# Altium schematic sheet Juglans.SchDoc
size A4
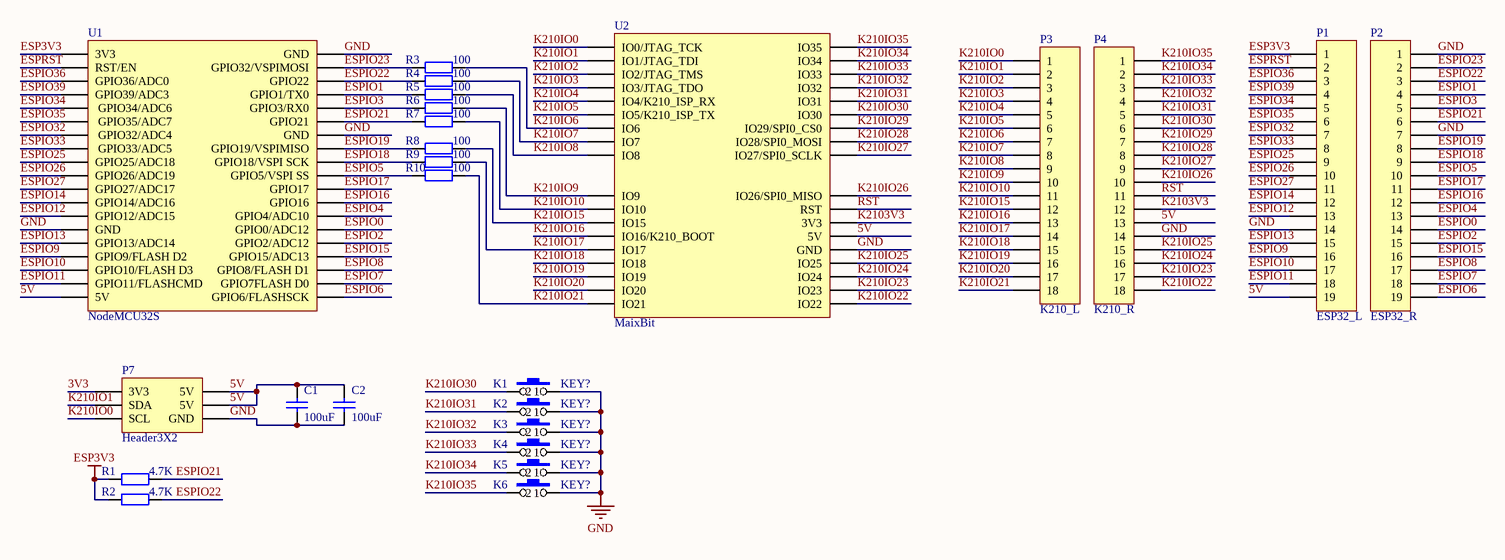
[diagram p0: Juglans.SchDoc]

## Parts
C1  value 100uF  [C 1206_L]  (hidden comment: Cap)
C2  value 100uF  [C 1206_L]  (hidden comment: Cap)
K1  KEY?  [SW-PB2-S]
K2  KEY?  [SW-PB2-S]
K3  KEY?  [SW-PB2-S]
K4  KEY?  [SW-PB2-S]
K5  KEY?  [SW-PB2-S]
K6  KEY?  [SW-PB2-S]
P1  ESP32_L  [HDR1X19]
P2  ESP32_R  [HDR1X19]
P3  K210_L  [HDR1X18]
P4  K210_R  [HDR1X18]
P7  Header3X2  [Header3X2]
R1  value 4.7K  [R 0805_M]  (hidden comment: Res2)
R2  value 4.7K  [R 0805_M]  (hidden comment: Res2)
R3  value 100  [R 0805_M]  (hidden comment: Res2)
R4  value 100  [R 0805_M]  (hidden comment: Res2)
R5  value 100  [R 0805_M]  (hidden comment: Res2)
R6  value 100  [R 0805_M]  (hidden comment: Res2)
R7  value 100  [R 0805_M]  (hidden comment: Res2)
R8  value 100  [R 0805_M]  (hidden comment: Res2)
R9  value 100  [R 0805_M]  (hidden comment: Res2)
R10  value 100  [R 0805_M]  (hidden comment: Res2)
U1  NodeMCU32S  [NodeMCU32S]
U2  MaixBit  [MaixBit]

## Nets
ESP3V3: P1.1 R1.2 R2.2 U1.0(3V3)
GND: C1.1 C2.1 K1.2 K2.2 K3.2 K4.2 K5.2 K6.2 P1.14 P2.1 P2.7 P4.14 P7.6(GND) U1.13(GND) U1.31(GND) U1.37(GND) U2.22(GND)
3V3: P7.1(3V3)
5V: C1.2 C2.2 P1.19 P4.13 P7.2(5V) P7.4(5V) U1.18(5V) U2.23(5V)
ESPIO0: P2.14 U1.24(GPIO0/ADC12)
ESPIO1: P2.4 R5.2 U1.34(GPIO1/TX0)
ESPIO2: P2.15 U1.23(GPIO2/ADC12)
ESPIO3: P2.5 R6.2 U1.33(GPIO3/RX0)
ESPIO4: P2.13 U1.25(GPIO4/ADC10)
ESPIO5: P2.10 R10.2 U1.28(GPIO5/VSPI_SS)
ESPIO6: P2.19 U1.19(GPIO6/FLASHSCK)
ESPIO7: P2.18 U1.20(GPIO7FLASH_D0)
ESPIO8: P2.17 U1.21(GPIO8/FLASH_D1)
ESPIO9: P1.16 U1.15(GPIO9/FLASH_D2)
ESPIO10: P1.17 U1.16(GPIO10/FLASH_D3)
ESPIO11: P1.18 U1.17(GPIO11/FLASHCMD)
ESPIO12: P1.13 U1.12(GPIO12/ADC15)
ESPIO13: P1.15 U1.14(GPIO13/ADC14)
ESPIO14: P1.12 U1.11(GPIO14/ADC16)
ESPIO15: P2.16 U1.22(GPIO15/ADC13)
ESPIO16: P2.12 U1.26(GPIO16)
ESPIO17: P2.11 U1.27(GPIO17)
ESPIO18: P2.9 R9.2 U1.29(GPIO18/VSPI_SCK)
ESPIO19: P2.8 R8.2 U1.30(GPIO19/VSPIMISO)
ESPIO21: P2.6 R1.1 R7.2 U1.32(GPIO21)
ESPIO22: P2.3 R2.1 R4.2 U1.35(GPIO22)
ESPIO23: P2.2 R3.2 U1.36(GPIO32/VSPIMOSI)
ESPIO25: P1.9 U1.8(GPIO25/ADC18)
ESPIO26: P1.10 U1.9(GPIO26/ADC19)
ESPIO27: P1.11 U1.10(GPIO27/ADC17)
ESPIO32: P1.7 U1.6(GPIO32/ADC4)
ESPIO33: P1.8 U1.7(GPIO33/ADC5)
ESPIO34: P1.5 U1.4(GPIO34/ADC6)
ESPIO35: P1.6 U1.5(GPIO35/ADC7)
ESPIO36: P1.3 U1.2(GPIO36/ADC0)
ESPIO39: P1.4 U1.3(GPIO39/ADC3)
ESPRST: P1.2 U1.1(RST/EN)
K210IO0: P3.1 P7.5(SCL) U2.0(IO0/JTAG_TCK)
K210IO1: P3.2 P7.3(SDA) U2.1(IO1/JTAG_TDI)
K210IO2: P3.3 U2.2(IO2/JTAG_TMS)
K210IO3: P3.4 U2.3(IO3/JTAG_TDO)
K210IO4: P3.5 U2.4(IO4/K210_ISP_RX)
K210IO5: P3.6 U2.5(IO5/K210_ISP_TX)
K210IO6: P3.7 R3.1 U2.6(IO6)
K210IO7: P3.8 R4.1 U2.7(IO7)
K210IO8: P3.9 R5.1 U2.8(IO8)
K210IO9: P3.10 R6.1 U2.9(IO9)
K210IO10: P3.11 R7.1 U2.10(IO10)
K210IO15: P3.12 R8.1 U2.11(IO15)
K210IO16: P3.13 U2.12(IO16/K210_BOOT)
K210IO17: P3.14 R9.1 U2.13(IO17)
K210IO18: P3.15 U2.14(IO18)
K210IO19: P3.16 U2.15(IO19)
K210IO20: P3.17 U2.16(IO20)
K210IO21: P3.18 R10.1 U2.17(IO21)
K210IO22: P4.18 U2.18(IO22)
K210IO23: P4.17 U2.19(IO23)
K210IO24: P4.16 U2.20(IO24)
K210IO25: P4.15 U2.21(IO25)
K210IO26: P4.10 U2.26(IO26/SPI0_MISO)
K210IO27: P4.9 U2.27(IO27/SPI0_SCLK)
K210IO28: P4.8 U2.28(IO28/SPI0_MOSI)
K210IO29: P4.7 U2.29(IO29/SPI0_CS0)
K210IO30: K1.1 P4.6 U2.30(IO30)
K210IO31: K2.1 P4.5 U2.31(IO31)
K210IO32: K3.1 P4.4 U2.32(IO32)
K210IO33: K4.1 P4.3 U2.33(IO33)
K210IO34: K5.1 P4.2 U2.34(IO34)
K210IO35: K6.1 P4.1 U2.35(IO35)
K2103V3: P4.12 U2.24(3V3)
RST: P4.11 U2.25(RST)

## Library data of the parts
C1 C2 = Cap: Capacitor; Published: 8-Jun-2000; LatestRevisionDate: 17-Jul-2002; LatestRevisionNote: Re-released for DXP Platform.; PackageReference: RAD-0.3; Publisher: Altium Limited; PackageDescription: Radial Cap, Thru-Hole; 2 Leads; 0.3 in Pin Spacing
K1-K6 = SW-PB2
P1 P2 = Header 19: Header, 19-Pin; LatestRevisionDate: 17-Jul-2002; LatestRevisionNote: Re-released for DXP Platform.; Publisher: Altium Limited
P3 P4 = Header 18: Header, 18-Pin; LatestRevisionDate: 17-Jul-2002; LatestRevisionNote: Re-released for DXP Platform.; Publisher: Altium Limited
P7 = H3X2
R1-R10 = Res2: Resistor; Published: 8-Jun-2000; LatestRevisionDate: 17-Jul-2002; LatestRevisionNote: Re-released for DXP Platform.; PackageReference: AXIAL-0.4; Publisher: Altium Limited; PackageDescription: Axial Device, Thru-Hole; 2 Leads; 0.4 in Pin Spacing